# EAGLE design battery-board (EAGLE 6.4)
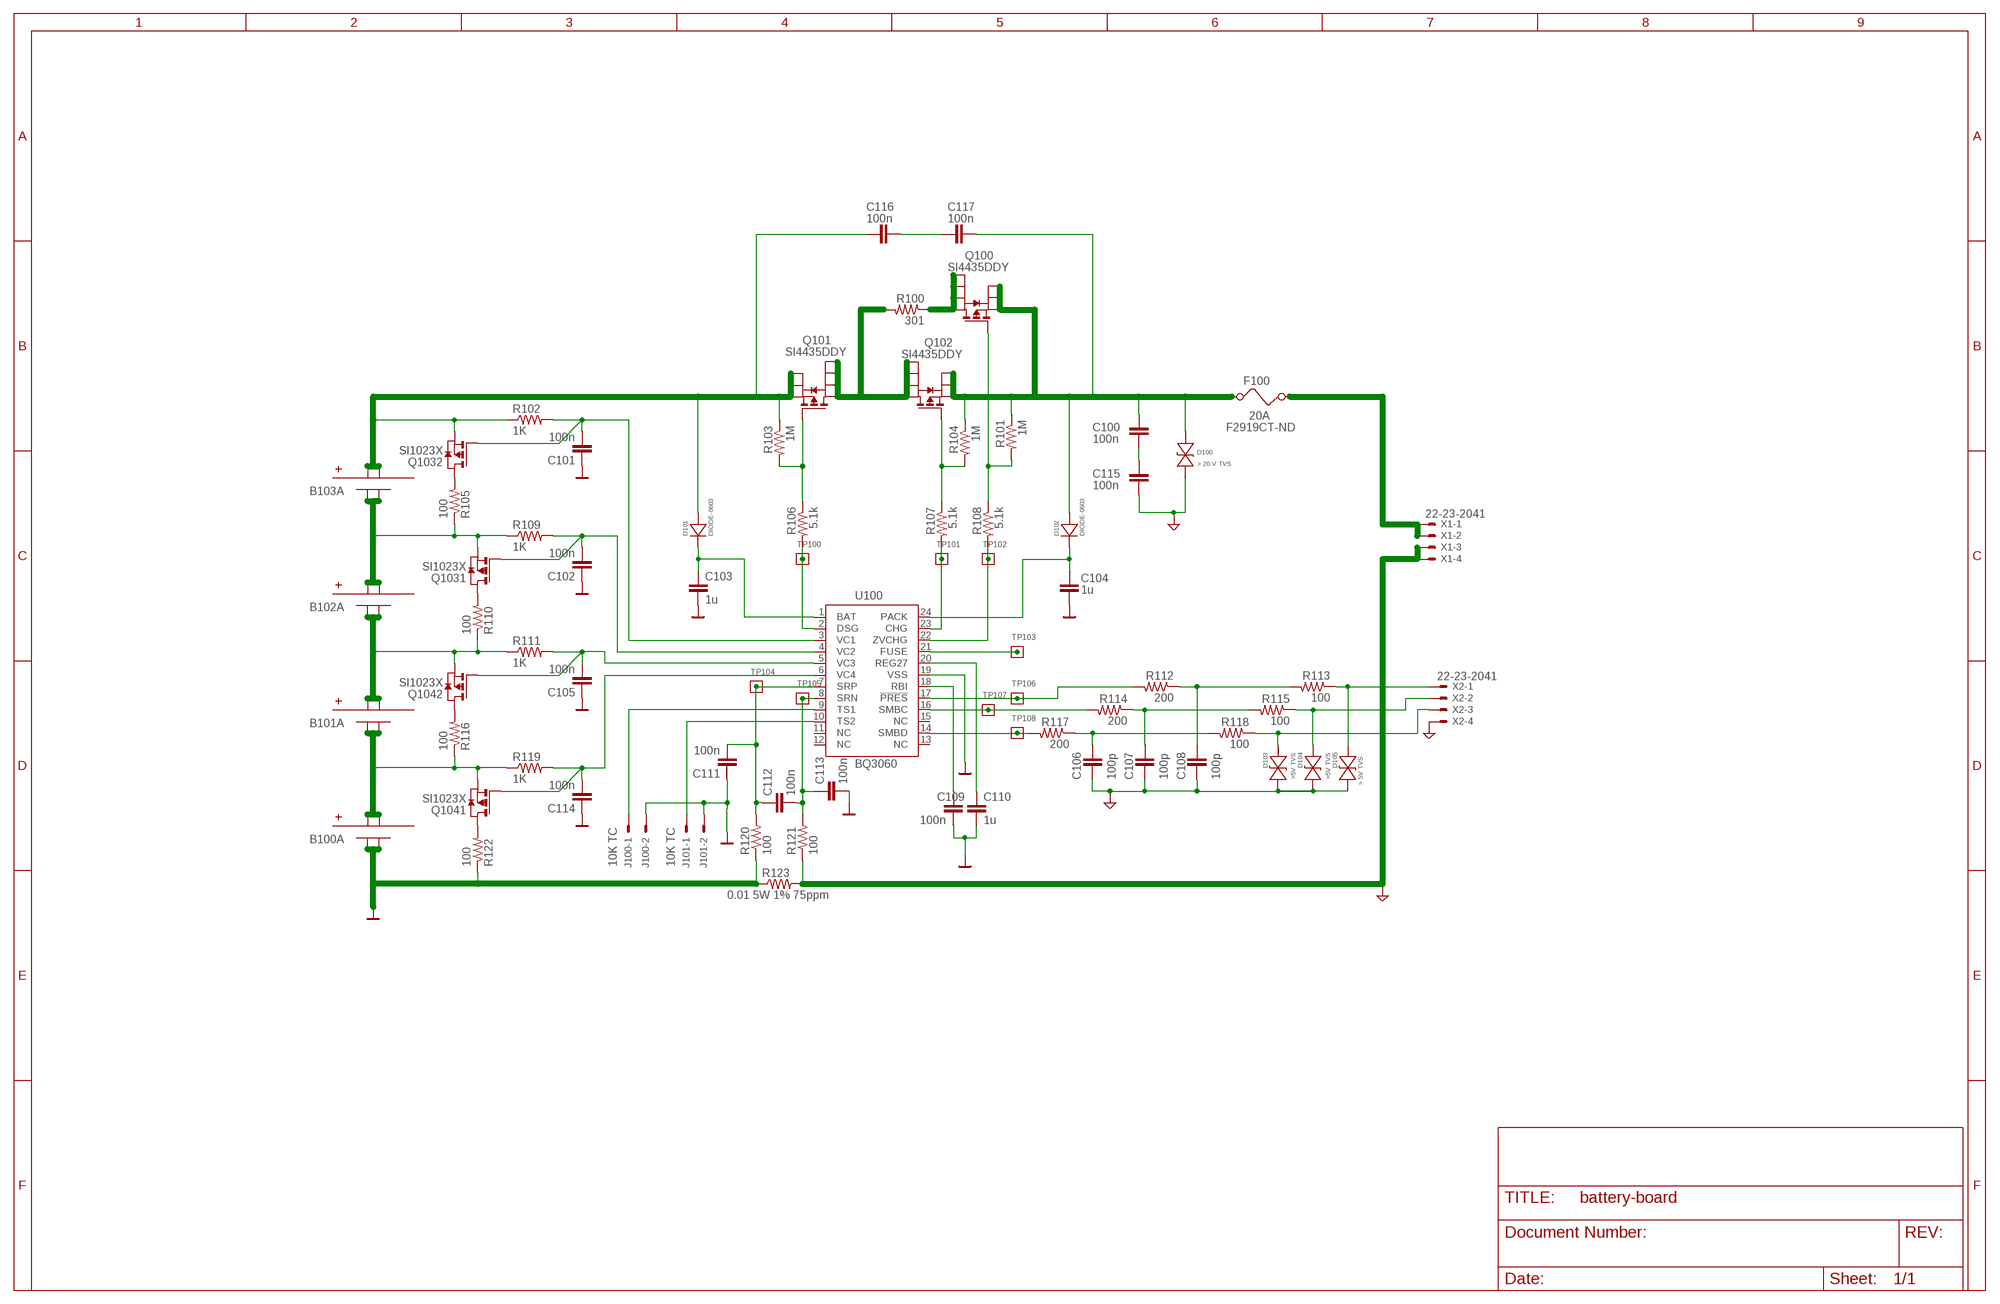
[diagram p0: schematic, sheet 1]

## Parts
B100A  LIPO-8AHR  [LIPO-8AHR-PAC]
B101A  LIPO-8AHR  [LIPO-8AHR-PAC]
B102A  LIPO-8AHR  [LIPO-8AHR-PAC]
B103A  LIPO-8AHR  [LIPO-8AHR-PAC]
C100  100n  C-EU0603-B-NOSILK  [0603-B-NOSILK]
C101  100n  C-EU0603-B-NOSILK  [0603-B-NOSILK]
C102  100n  C-EU0603-B-NOSILK  [0603-B-NOSILK]
C103  1u  C-EU0603-B-NOSILK  [0603-B-NOSILK]
C104  1u  C-EU0603-B-NOSILK  [0603-B-NOSILK]
C105  100n  C-EU0603-B-NOSILK  [0603-B-NOSILK]
C106  100p  C-EU0603-B-NOSILK  [0603-B-NOSILK]
C107  100p  C-EU0603-B-NOSILK  [0603-B-NOSILK]
C108  100p  C-EU0603-B-NOSILK  [0603-B-NOSILK]
C109  100n  C-EU0603-B-NOSILK  [0603-B-NOSILK]
C110  1u  C-EU0603-B-NOSILK  [0603-B-NOSILK]
C111  100n  C-EU0603-B-NOSILK  [0603-B-NOSILK]
C112  100n  C-EU0603-B-NOSILK  [0603-B-NOSILK]
C113  100n  C-EU0603-B-NOSILK  [0603-B-NOSILK]
C114  100n  C-EU0603-B-NOSILK  [0603-B-NOSILK]
C115  100n  C-EU0603-B-NOSILK  [0603-B-NOSILK]
C116  100n  C-EU0603-B-NOSILK  [0603-B-NOSILK]
C117  100n  C-EU0603-B-NOSILK  [0603-B-NOSILK]
D100  > 20 V TVS  TVS-0603  [0603-B-NOSILK-DIODE]
D101  DIODE-0603  [0603-B-NOSILK-DIODE]
D102  DIODE-0603  [0603-B-NOSILK-DIODE]
D103  >5V TVS  TVS-0603  [0603-B-NOSILK-DIODE]
D104  >5V TVS  TVS-0603  [0603-B-NOSILK-DIODE]
D105  > 5V TVS  TVS-0603  [0603-B-NOSILK-DIODE]
F100  20A  FUSE1206  [1206]
J100  87758-0216  [87758-0216]
J101  87758-0216  [87758-0216]
Q100  SI4435DDY  [SO-8]
Q101  SI4435DDY  [SO-8]
Q102  SI4435DDY  [SO-8]
Q103  SI1023X  [SOT-563]
Q104  SI1023X  [SOT-563]
R100  301  R-US_1206-B  [1206-B]
R101  1M  R-US_0603-B-NOSILK  [0603-B-NOSILK]
R102  1K  R-US_0603-B-NOSILK  [0603-B-NOSILK]
R103  1M  R-US_0603-B-NOSILK  [0603-B-NOSILK]
R104  1M  R-US_0603-B-NOSILK  [0603-B-NOSILK]
R105  100  R-US_0603-B-NOSILK  [0603-B-NOSILK]
R106  5.1k  R-US_0603-B-NOSILK  [0603-B-NOSILK]
R107  5.1k  R-US_0603-B-NOSILK  [0603-B-NOSILK]
R108  5.1k  R-US_0603-B-NOSILK  [0603-B-NOSILK]
R109  1K  R-US_0603-B-NOSILK  [0603-B-NOSILK]
R110  100  R-US_0603-B-NOSILK  [0603-B-NOSILK]
R111  1K  R-US_0603-B-NOSILK  [0603-B-NOSILK]
R112  200  R-US_0603-B-NOSILK  [0603-B-NOSILK]
R113  100  R-US_0603-B-NOSILK  [0603-B-NOSILK]
R114  200  R-US_0603-B-NOSILK  [0603-B-NOSILK]
R115  100  R-US_0603-B-NOSILK  [0603-B-NOSILK]
R116  100  R-US_0603-B-NOSILK  [0603-B-NOSILK]
R117  200  R-US_0603-B-NOSILK  [0603-B-NOSILK]
R118  100  R-US_0603-B-NOSILK  [0603-B-NOSILK]
R119  1K  R-US_0603-B-NOSILK  [0603-B-NOSILK]
R120  100  R-US_0603-B-NOSILK  [0603-B-NOSILK]
R121  100  R-US_0603-B-NOSILK  [0603-B-NOSILK]
R122  100  R-US_0603-B-NOSILK  [0603-B-NOSILK]
R123  0.01 5W 1% 75ppm  R-US-2818  [VISHAY-2818]
TP100  TEST-POINT  [2MM-TEST-POINT]
TP101  TEST-POINT  [2MM-TEST-POINT]
TP102  TEST-POINT  [2MM-TEST-POINT]
TP103  TEST-POINT  [2MM-TEST-POINT]
TP104  TEST-POINT  [2MM-TEST-POINT]
TP105  TEST-POINT  [2MM-TEST-POINT]
TP106  TEST-POINT  [2MM-TEST-POINT]
TP107  TEST-POINT  [2MM-TEST-POINT]
TP108  TEST-POINT  [2MM-TEST-POINT]
U100  BQ3060PW  [PW-R-PDSO-G24]
X1  22-23-2041  [22-23-2041]
X2  22-23-2041  [22-23-2041]

## Nets
B+: B103A.B+@1(B+) B103A.B+@2(B+) C116.1 D101.ANODE Q101.1(S) Q101.2(S) Q101.3(S) Q103.4(2:S) R102.1 R103.1
BAR_GND: B100A.B-@1(B-) B100A.B-@2(B-) C101.1 C102.1 C103.2 C104.2 C105.1 C109.2 C110.2 C111.1 C113.2 C114.1 J100.2 J101.2 R120.1 R122.1 R123.P$1 U100.19(VSS) ; supply symbol labelled SUP_GND_BAR
N$1: J100.1 U100.9(TS1)
N$2: J101.1 U100.10(TS2)
N$3: C103.1 D101.CATHODE U100.1(BAT)
N$4: B101A.B+@1(B+) B101A.B+@2(B+) B102A.B-@1(B-) B102A.B-@2(B-) Q104.4(2:S) R110.1 R111.1
N$5: C111.2 C112.1 R120.2 TP104.1 U100.7(SRP)
N$6: C112.2 C113.1 R121.2 TP105.1 U100.8(SRN)
N$7: B100A.B+@1(B+) B100A.B+@2(B+) B101A.B-@1(B-) B101A.B-@2(B-) Q104.1(1:S) R116.1 R119.1
N$8: B102A.B+@1(B+) B102A.B+@2(B+) B103A.B-@1(B-) B103A.B-@2(B-) Q103.1(1:S) R105.1 R109.1
N$9: Q104.3(2:D) R116.2
N$10: C102.2 Q103.2(1:G) R109.2 U100.4(VC2)
N$11: C105.2 Q104.5(2:G) R111.2 U100.5(VC3)
N$12: C114.2 Q104.2(1:G) R119.2 U100.6(VC4)
N$13: C109.1 U100.18(RBI)
N$14: C110.1 U100.20(REG27)
N$15: R117.2 TP108.1 U100.14(SMBD)
N$16: R114.2 TP107.1 U100.16(SMBC)
N$17: C106.1 R117.1 R118.2
N$18: Q104.6(1:D) R122.2
N$19: C101.2 Q103.5(2:G) R102.2 U100.3(VC1)
N$20: Q103.6(1:D) R110.2
N$21: Q103.3(2:D) R105.2
N$22: D103.ANODE R118.1 X2.3
N$24: C107.1 R114.1 R115.2
N$25: D104.ANODE R115.1 X2.2
N$26: F100.2 X1.1 X1.2
N$27: R106.2 TP100.1 U100.2(DSG)
N$28: Q101.5(D) Q101.6(D) Q101.7(D) Q101.8(D) Q102.5(D) Q102.6(D) Q102.7(D) Q102.8(D) R100.2
N$29: R108.2 TP102.1 U100.22(ZVCHG)
N$30: R107.2 TP101.1 U100.23(CHG)
N$31: C104.1 D102.CATHODE U100.24(PACK)
N$33: C108.1 R112.1 R113.2
N$34: Q101.4(G) R103.2 R106.1
N$35: D105.ANODE R113.1 X2.1
N$36: Q102.4(G) R104.2 R107.1
N$37: C100.2 C115.1
N$38: TP103.1 U100.21(FUSE)
N$39: Q100.4(G) R101.2 R108.1
N$40: C116.2 C117.1
N$41: Q100.5(D) Q100.6(D) Q100.7(D) Q100.8(D) R100.1
N$43: C100.1 C117.2 D100.ANODE D102.ANODE F100.1 Q100.1(S) Q100.2(S) Q100.3(S) Q102.1(S) Q102.2(S) Q102.3(S) R101.1 R104.1
N$45: R112.2 TP106.1 U100.17(!PRES)
TRIANGLE_GND: C106.2 C107.2 C108.2 C115.2 D100.CATHODE D103.CATHODE D104.CATHODE D105.CATHODE R121.1 R123.P$2 X1.3 X1.4 X2.4 ; supply symbol labelled SUP_GND_TRIANGLE
Unconnected: U100.11(NC) U100.12(NC) U100.13(NC) U100.15(NC)

## Notes on the sheet
- 10K TC | 10K TC

## Library data of the parts
B100A B101A B102A B103A = battery:LIPO-8AHR
C100-C117 = rcl_custom:C-EU: CAPACITOR, European symbol
D100 D103-D105 = tvs-0603:TVS-0603
D101 D102 = diode-0603:DIODE-0603
F100 = psas:FUSE: Fuse; DK: F2919CT-ND
J100 J101 = con-molex:87758-0216: 2 Pin - 2mm Dual Row Single Wafer, Vertical T/H HDR Source: http://www.molex.com/pdm_docs/sd/877580616_sd.pdf; MPN: 87758-0216; OC_FARNELL: unknown; OC_NEWARK: 94M1513
Q100-Q102 = si4435ddy:SI4435DDY
Q103 Q104 = si1023x:SI1023X
R100-R122 = rcl_custom:R-US_: RESISTOR, American symbol
R123 = shunt:R-US-2818
TP100-TP108 = Tova:TEST-POINT
U100 = bq3060:BQ3060
X1 X2 = con-molex:22-23-2041: .100" (2.54mm) Center Header - 4 Pin; MF: MOLEX; MPN: 22-23-2041; OC_FARNELL: 1462920; OC_NEWARK: 38C0355

## Board
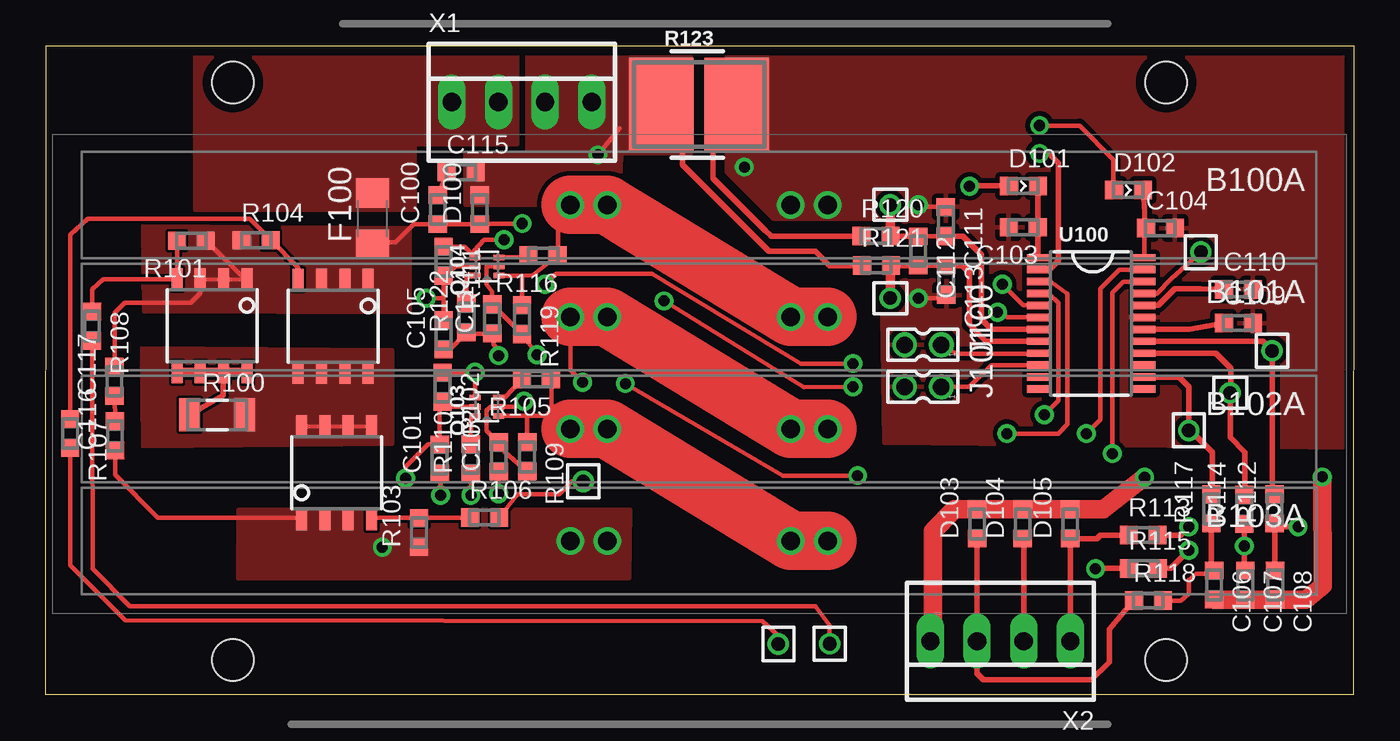
[diagram p1: board, top side]
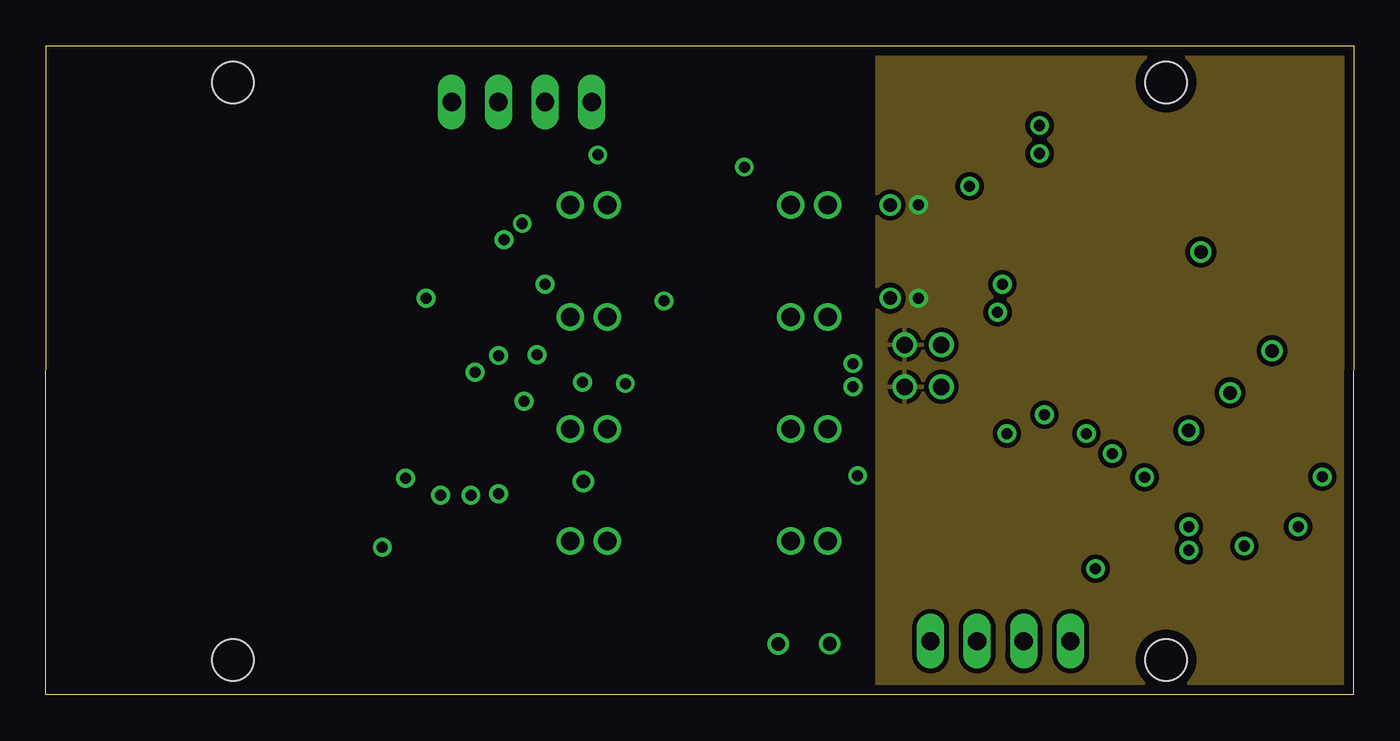
[diagram p2: board, inner layer Route2]
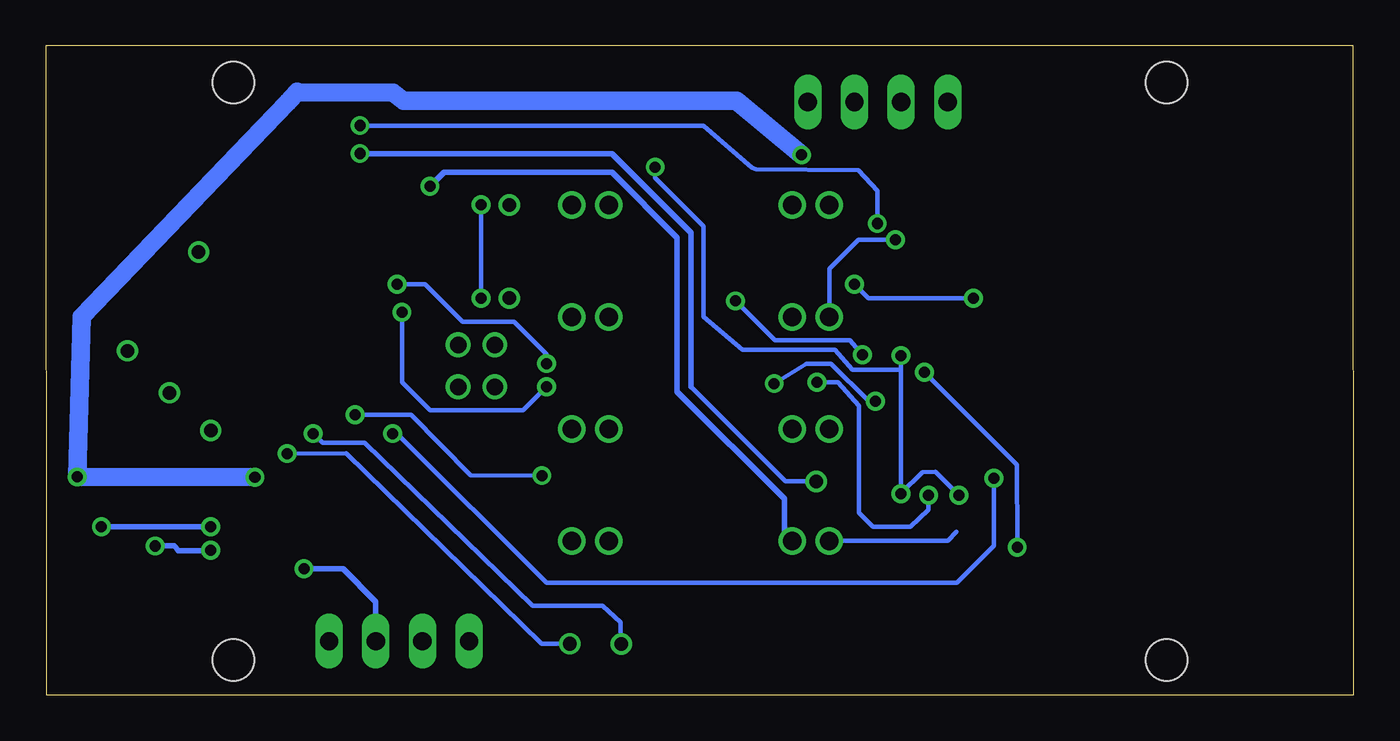
[diagram p3: board, bottom side, seen from below]

Size 71.2 x 35.32 mm. Coordinates in mm from the lower left corner, seen from the top.
Outline: 0,0 0.03,35.32 71.2,35.32 71.17,0 0,0
Copper layers (1+2*3+16): Top 0.0432mm / dielectric 12mil / Route2 0.0356mm / dielectric 28mil / Route3 0.0356mm / dielectric 12mil / Bottom 0.0432mm
Design rules "default": minimum track width 6mil, minimum drill 8mil, track to track 6mil, track to pad 6mil, pad to pad 6mil, via to via 6mil, smd to smd 6mil, copper to edge 20mil, drill to drill 16mil, minimum pad ring 0.2118mm, minimum via ring 0.2118mm, stop-mask expansion 3mil, vias tented up to drill 0mil, thermal gap 10mil
Holes 2.26 mm at 60.99,1.91 10.19,1.91 60.99,33.34 10.19,33.34
tKeepout: area 59,31.3 to 63,35.4; area 8.2,31.3 to 12.2,35.4; area 8.2,-0.1 to 12.2,3.9; area 59,-0.1 to 63,3.9
bRestrict: area 0,30.5 to 71.2,35.2; area 0,0 to 71.2,4.4

### Footprints (pad centres in the part's own frame; a part is rotated, then mirrored left to right if it is on the bottom)
LIPO-8AHR-PAC = drill 1: B+@1 5,0; B+@2 7,0; B-@1 -5,0; B-@2 -7,0
0603-B-NOSILK = smd 0.95 x 1: 1 -0.8,0; 2 0.8,0
0603-B-NOSILK-DIODE = smd 0.95 x 1: ANODE -0.8,0; CATHODE 0.8,0
1206 = smd 1.6 x 1.8: 1 -1.4,0; 2 1.4,0
87758-0216 = drill 0.9 pad 1.27: 1 0,-1; 2 0,1
SO-8 = smd 0.6 x 1.2: 1 -1.905,-2.527; 2 -0.635,-2.527; 3 0.635,-2.527; 4 1.905,-2.527; 5 1.905,2.527; 6 0.635,2.527; 7 -0.635,2.527; 8 -1.905,2.527
SOT-563 = smd 0.3 x 0.6: 1 -0.5,-0.65; 2 0,-0.65; 3 0.5,-0.65; 4 0.5,0.65; 5 0,0.65; 6 -0.5,0.65
1206-B = smd 1.15 x 1.8: 1 -1.5,0; 2 1.5,0
VISHAY-2818 = smd 3.5 x 5.1: P$1 2.055,0; P$2 -2.055,0
2MM-TEST-POINT = drill 0.737: 1 0,0
PW-R-PDSO-G24 = smd 0.4 x 1.2: 1 -3.575,-2.9; 2 -2.925,-2.9; 3 -2.275,-2.9; 4 -1.625,-2.9; 5 -0.975,-2.9; 6 -0.325,-2.9; 7 0.325,-2.9; 8 0.975,-2.9; 9 1.625,-2.9; 10 2.275,-2.9; 11 2.925,-2.9; 12 3.575,-2.9; 13 3.575,2.9; 14 2.925,2.9; 15 2.275,2.9; 16 1.625,2.9; 17 0.975,2.9; 18 0.325,2.9; 19 -0.325,2.9; 20 -0.975,2.9; 21 -1.625,2.9; 22 -2.275,2.9; 23 -2.925,2.9; 24 -3.575,2.9
22-23-2041 = drill 1 long: 1 -3.81,0; 2 -1.27,0; 3 1.27,0; 4 3.81,0

### Placement (x,y rotation side)
B100A  35.56,26.67 180 top
B101A  35.56,20.57 180 top
B102A  35.56,14.48 180 top
B103A  35.56,8.38 180 top
C100  21.34,26.42 90 top
C101  21.44,12.84 90 top
C102  24.65,12.95 90 top
C103  53.21,25.45 180 top
C104  60.67,25.4 0 top
C105  21.65,19.61 90 top
C106  63.61,5.98 270 top
C107  65.3,5.97 270 top
C108  66.93,5.98 270 top
C109  64.91,20.23 0 top
C110  64.91,22.07 0 top
C111  49,25.76 270 top
C112  47.5,24.16 270 top
C113  49.02,22.56 270 top
C114  24.3,20.47 90 top
C115  22.61,28.45 0 top
C116  3.76,14.1 90 top
C117  3.73,17.07 90 top
D100  23.62,26.42 90 top
D101  53.21,27.7 0 top
D102  58.93,27.47 0 top
D103  50.7,9.3 90 top
D104  53.17,9.3 90 top
D105  55.77,9.3 90 top
F100  17.78,25.91 90 top
J100  47.75,19.05 90 top
J101  47.75,16.76 90 top
Q100  9.04,20.09 180 top
Q101  15.82,12.09 0 top
Q102  15.65,20.07 180 top
Q103  24.01,15.68 90 top
Q104  24.02,23.32 90 top
R100  9.32,15.24 0 top
R101  7.92,24.71 180 top
R102  21.59,16.75 270 top
R103  20.32,8.84 90 top
R104  11.46,24.74 0 top
R105  26.72,17.18 180 top
R106  23.88,9.65 0 top
R107  1.32,14.22 270 top
R108  2.51,20.07 270 top
R109  26.2,12.95 270 top
R110  23.13,12.85 90 top
R111  21.65,23.6 270 top
R112  66.9,10.12 90 top
R113  59.74,8.69 0 top
R114  65.25,10.1 90 top
R115  59.76,6.89 0 top
R116  27.08,23.91 180 top
R117  63.45,10.12 90 top
R118  60.02,5.14 0 top
R119  25.92,20.42 270 top
R120  45.19,24.97 0 top
R121  45.21,23.37 0 top
R122  22.9,20.52 90 top
R123  35.56,32.13 0 top
TP100  29.26,11.62 180 top
TP101  39.88,2.77 180 top
TP102  42.67,2.78 180 top
TP103  62.88,24.1 180 top
TP104  45.97,26.67 90 top
TP105  45.97,21.59 90 top
TP106  66.76,18.73 180 top
TP107  64.47,16.44 90 top
TP108  62.22,14.4 180 top
U100  56.9,20.22 270 top
X1  25.91,32.26 0 top
X2  51.97,2.92 180 top

### Tracks (layer width: path | path; a pad name or v marks a point on that pad's centre or on a via)
B+  (via drill 0.6)
  Top 0.254: C116.1 3.76,11.99 6.1,9.65 13.83,9.65 Q101.1 | R103.1 20.48,8.04 20.57,8.13 | Q103.4 23.37,16.19 v23.37,17.55 R102.1 | v18.31,8.03 18.29,8.05
  Top 0.305: D101.ANODE 50.3,27.7 v50.29,27.69
  Bottom 0.254: 21.61,8.89 22.1,8.38 B103A.B+@2 | v18.31,8.03 18.31,8.34 18.34,12.42 18.34,12.52 v23.37,17.55
  Bottom 0.305: v50.29,27.69 49.53,28.45 40.39,28.45 36.83,24.89 36.83,16.51 30.99,10.67 30.99,8.97 B103A.B+@1
  pour Top (no thermals): 31.8,10.08 10.49,10.08 10.46,6.35 31.75,6.35
BAR_GND  (via drill 0.6)
  Top 0.254: 24.3,19.65 24.38,19.56 | 24.38,19.56 24.38,19.81 | C114.1 24.3,19.65 | 24.3,19.65 22.97,19.65 R122.1 21.97,18.8 21.59,18.8 21.6,18.81 C105.1 | 24.69,11.94 C102.1 | C102.1 24.64,12.04 v24.64,10.95 | 24.38,19.56 24.38,19.05 24.64,18.8 v24.64,18.47 | 38.46,31.22 R123.P$1 | 24.64,12.17 C102.1 | C101.1 21.59,12.04 21.61,12.06 21.49,12.06 v21.49,10.87 | C111.1 47.5,26.56 v47.5,26.67 | v47.5,21.59 49.02,21.59 C113.2
  Top 0.305: R123.P$1 36.37,31.02 36.37,30.12 36.32,30.07 36.32,28.12 39.17,25.27 39.47,24.99 39.5,24.97 R120.1
  Top 0.508: 37.65,32.26 R123.P$1
  Bottom 0.254: v24.64,18.47 24.64,17.7 | 24.64,17.7 v24.64,10.95 v24.65,10.96 | 24.64,17.7 27.28,17.7 28.25,18.77 33.27,18.8 35.38,20.57 35.38,25.5 38.02,28.14 v38.02,28.73 | v24.65,10.96 23.47,12.12 22.76,12.14 21.74,11.1 v21.49,10.87 | v24.65,10.96 | v47.5,26.67 v47.5,21.59
  pour Top (isolate 0.254): 37.08,28.45 39.62,25.91 45.47,25.91 45.65,13.72 71.3,13.46 71.12,35.31 37.08,35.31
  pour Route2 (isolate 0.254): 45.26,34.99 45.26,-0.06 73.46,-0.32 73.2,34.99
  pour Top (no thermals): 39.62,27.69 43.69,27.69 43.69,25.91 39.62,25.91
N$1
  Top 0.254: U100.9 53.65,18.57 49.59,18.57 48.77,19.05 J100.1
N$2
  Top 0.254: U100.10 51.47,17.94 50.29,16.76 J101.1
N$3
  Top 0.254: 53.74,25.47 C103.1
  Top 0.305: U100.1 54,25.43 C103.1 D101.CATHODE
N$4  (via drill 0.6)
  Top 0.254: v24.94,24.77 23.85,24.76 23.32,24.18 23.32,23.8 Q104.4 22.79,24.4 R111.1 | 29.21,19.92 B101A.B+@2 28.56,17.67 v29.21,17.02 | R110.1 23.14,11.96 v23.14,10.87
  Top 3.175: B101A.B+@2 B101A.B+@1 B102A.B-@1 B102A.B-@2
  Bottom 0.254: v24.94,24.77 26.95,24.77 28.55,23.19 28.55,20.69 B101A.B+@2 | v23.14,10.87 23.14,10.08 24.13,9.14 26.16,9.14 26.92,9.91 26.92,15.75 28.07,17.02 v29.21,17.02
N$5
  Top 0.254: C112.1 C111.2
  Top 0.305: R120.2 47.48,24.97 C112.1 | C111.2 49.92,24.96 50.93,23.95 50.93,20.45 51.49,19.89 U100.7
  Top 0.508: TP104.1 45.97,24.93 R120.2
N$6
  Top 0.254: C112.2 C113.1 | C113.1
  Top 0.305: 46.08,23.36 C112.2 | C113.1 49.9,23.36 50.27,22.99 50.27,20.17 51.18,19.25 53.99,19.25 U100.8
  Top 0.406: 45.97,23.37 45.97,23.11
  Top 0.508: 46.08,23.36 R121.2 45.97,23.33 45.97,23.11 TP105.1
N$7
  Top 0.254: 30.89,25.02 31.56,25.69 31.56,26.06 | Q104.1 25.91,22.82 | 25.91,22.82 26.5,22.84 R116.1 27.88,25.5 B100A.B+@2 | R119.1 25.92,22.8 25.91,22.82
  Top 3.175: B100A.B+@2 B100A.B+@1 31.56,26.06 B101A.B-@1 B101A.B-@2
N$8
  Top 0.254: R105.1 27.52,15.52 B102A.B+@2 27.86,15.18 26.14,15.18 | 26.14,15.18 Q103.1 | R109.1 26.2,15.12 26.14,15.18
  Top 3.175: B102A.B+@2 B102A.B+@1 B103A.B-@1 B103A.B-@2
N$9
  Top 0.254: Q104.3 25.79,23.82 R116.2
N$10  (via drill 0.6)
  Top 0.254: U100.4 54.61,21.84 55.12,21.34 55.12,16 v54.36,15.24 | R109.2 24.7,13.47 C102.2 24,14.38 24,15.49 24.21,15.68 Q103.2 25.59,15.68 v26.04,15.98 | v44.2,11.94 40.13,11.94 v31.55,16.94
  Bottom 0.254: v54.36,15.24 51.31,15.24 48.08,11.96 v44.2,11.94 | v26.04,15.98 26.42,16 28.45,18.03 29.79,18.03 v31.55,16.94
N$11  (via drill 0.6)
  Top 0.254: Q104.5 22.35,23.32 R111.2 21.65,21.59 | 21.65,21.59 C105.2 | U100.5 53.23,21.19 v52.07,22.35 | v27.18,22.35 27.76,22.91 32.99,22.91 41.1,18.03 v43.94,18.03 | v20.7,21.59 21.65,21.59
  Bottom 0.254: v52.07,22.35 50.55,22.35 48.51,20.32 45.72,20.32 43.94,18.54 v43.94,18.03 | v27.18,22.35 26.42,21.59 v20.7,21.59
N$12  (via drill 0.6)
  Top 0.254: U100.6 52.35,20.54 v51.82,20.83 | Q104.2 24,23.32 24,22.35 24.3,21.93 C114.2 24.3,21.25 R119.2 v26.75,18.52 | v33.66,21.44 41.27,16.74 v43.94,16.76
  Bottom 0.254: v51.82,20.83 51.82,17.02 50.29,15.49 45.21,15.49 v43.94,16.76 | v33.66,21.44 31.5,19.3 27.43,19.3 v26.75,18.52
N$13
  Top 0.305: U100.18 62.25,19.89 C109.1
N$14
  Top 0.305: U100.20 60.56,21.19 61.47,22.1 62.81,22.1 C110.1
N$15
  Top 0.305: U100.14 61.7,17.29 62.23,16.76 TP108.1 62.31,14.4 63.5,13.21 63.5,10.97 R117.2
N$16
  Top 0.305: U100.16 63.7,18.59 64.52,17.78 64.52,16.48 TP107.1 64.47,14.01 65.28,13.21 65.28,10.93 R114.2
N$17
  Top 0.254: R118.2 61.8,5.13 62.23,5.51 62.23,6.27 62.64,6.6 63.38,6.6 C106.1
  Top 0.305: R117.1 63.45,6.93 C106.1
N$18
  Top 0.254: R122.2 22.9,22.82 Q104.6
N$19  (via drill 0.6)
  Top 0.254: U100.3 54.72,22.49 55.63,21.84 55.63,14.73 55.12,14.22 v52.32,14.22 | Q103.5 21.89,15.68 R102.2 21.44,15.56 C101.2 20.8,13.64 19.58,12.42 v19.58,11.79
  Bottom 0.254: v52.32,14.22 52.07,14.22 43.94,6.1 21.59,6.1 19.58,8.1 v19.58,11.79
N$20
  Top 0.254: R110.2 23.15,15.03 Q103.6
N$21
  Top 0.254: Q103.3 24.97,16.18 R105.2
N$22
  Top 0.254: X2.3 50.7,2.9
  Top 0.305: R118.1 57.91,3.58 57.91,1.78 56.92,0.81 51.05,0.81 50.7,1.17 50.7,2.9 | D103.ANODE X2.3
N$24  (via drill 0.6)
  Top 0.305: R114.1 v65.25,8.1 65.25,6.92 C107.1 | R115.2 61.24,6.89 v62.23,7.87
  Bottom 0.305: v62.23,7.87 62.2,7.87 62.23,7.85 63.96,7.85 | 63.98,7.85 63.96,7.85 | 63.96,7.85 64.21,8.1 v65.25,8.1
N$25  (via drill 0.6)
  Top 0.305: X2.2 53.24,8.44 D104.ANODE | R115.1 57.18,6.89 v57.15,6.86
  Bottom 0.305: v57.15,6.86 55.02,6.86 53.24,5.08 X2.2
N$26
  pour Top (isolate 0.254, rank 3, no thermals): 8.13,35.31 8.13,26.42 20.07,26.42 20.07,29.97 25.65,29.97 25.65,35.05
N$27  (via drill 0.6)
  Top 0.254: R106.2 25.69,10.92 27.94,10.92 28.64,11.62 TP100.1
  Top 0.305: U100.2 54.64,23.14 55.12,23.62 55.12,28.96 54.61,29.46 v54.1,29.46
  Bottom 0.254: 36.07,16.76 30.92,11.62 TP100.1
  Bottom 0.305: v54.1,29.46 40.39,29.46 36.07,25.15 36.07,16.76
N$28
  Top 0.254: 17.69,14.58 Q101.8
  pour Top (rank 3, no thermals): 18.85,13.68 5.31,13.53 5.23,18.86 18.85,18.76
N$29  (via drill 0.6)
  Top 0.254: U100.22 58.65,22.48 58.06,21.89 v58.06,13.13 | TP102.1 42.67,3.79 41.91,4.83 4.57,4.83 2.54,6.86 2.52,16 R108.2
  Bottom 0.254: v58.06,13.13 54.86,13.16 44.21,2.78 TP102.1
N$30  (via drill 0.6)
  Top 0.254: R107.2 1.32,7.06 4.32,4.06 38.99,4.01 39.01,4.01 39.88,3.23 TP101.1 | U100.23 58.45,23.14 57.4,22.1 57.4,14.99 v56.64,14.22
  Bottom 0.254: v56.64,14.22 56.13,13.72 53.85,13.72 44.7,4.85 40.89,4.85 39.9,3.96 TP101.1
N$31
  Top 0.254: U100.24 59.8,27.11 C104.1 D102.CATHODE
N$33  (via drill 0.6)
  Top 0.305: C108.1 66.9,6.98 R112.1 67.07,9.14 v68.17,9.14 | R113.2 61.78,8.69 v62.23,9.14
  Bottom 0.305: v62.23,9.14 v68.17,9.14
N$34
  Top 0.254: Q101.4 17.8,9.64 R103.2 22.81,9.64 R106.1
N$35
  Top 0.305: X2.1 55.78,8.47 D105.ANODE 57.23,8.51 57.4,8.68 58.82,8.68 R113.1
N$36
  Top 0.254: Q102.4 13.74,23.25 R104.2 11.09,25.91 2.29,25.91 1.32,25.04 R107.1
N$37
  Top 0.203: C115.1 C100.2
N$38
  Top 0.254: U100.21 60.48,21.84 61.28,22.65 62.91,24.13 TP103.1
N$39
  Top 0.254: R101.2 7.14,24.7 Q100.4 3.12,22.63 2.52,22.07 R108.1
N$40
  Top 0.254: C117.1 C116.2
N$41
  Top 0.305: R100.1 9.65,16.3 Q100.7
  Top 0.508: Q100.5 Q100.6 Q100.7 Q100.8
N$43  (via drill 0.6)
  Top 0.254: C117.2 3.73,20.8 4.29,21.34 7.87,21.34 8.41,21.87 Q100.3 10.87,22.59 R101.1 | F100.1 17.91,24.64 19.05,24.64 20.03,25.62 C100.1 D100.ANODE 23.66,25.65 v25.93,25.65 | v54.1,30.99 56.29,30.99 58.12,29.13 58.13,29.12 D102.ANODE
  Bottom 0.254: v25.93,25.65 25.93,27.43 26.95,28.55 32.54,28.6 32.77,28.68 35.38,30.96 v54.1,30.99
  pour Top (rank 3, no thermals): 19.81,20.83 5.36,20.87 5.28,25.51 19.81,25.4
N$45
  Top 0.305: U100.17 66.24,19.24 TP106.1 66.76,11.06 R112.2
TRIANGLE_GND  (via drill 0.6)
  Top 0.254: 49.47,10.1 49.33,9.96 49.33,9.86 | 31.23,30.84 v30.05,29.39
  Top 0.305: R121.1 42.67,23.37 41.88,24.16 39.37,24.16 34.67,28.85 34.67,30.61 34.8,30.73 34.8,30.96 R123.P$2
  Top 1.016: X2.4 48.28,3.05 48.28,8.91 49.47,10.1 D103.CATHODE D104.CATHODE D105.CATHODE 57.58,10.1 v59.82,11.84 | v69.49,11.86 69.52,5.94 68.61,5.18 C108.2 C107.2 C106.2
  Bottom 1.016: v59.82,11.84 v69.49,11.86 69.26,20.57 58.04,32.26 | 58.04,32.26 57.51,32.82 | v30.05,29.39 33.6,32.34 51.71,32.33 | 51.71,32.33 51.66,32.33 | 58.04,32.26 58.02,32.28 57.53,32.79 52.3,32.77 51.71,32.33
  pour Top (isolate 0.254, rank 3, no thermals): 26.21,35.24 26.21,29.46 22.86,29.46 22.86,26.67 31.24,26.67 31.32,29.49 35.13,29.49 35.1,35.24